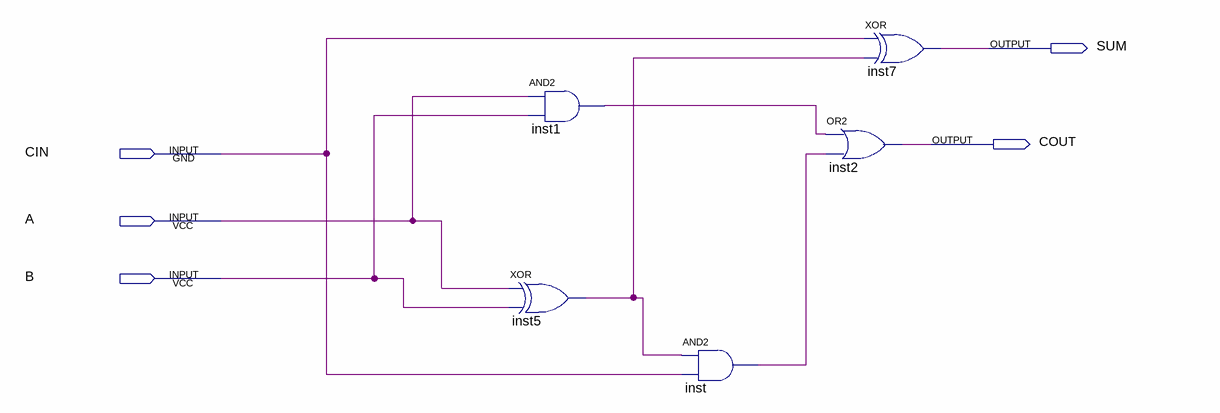
[diagram p0: schematic sheet]
// Quartus schematic full_adder_1bit.bdf as structural Verilog: 5 symbols, 5 pins
module full_adder_1bit (
  input  CIN,
  input  A,
  input  B,
  output SUM,
  output COUT
);

  wire inst1_out, inst5_out, inst_out;

  xor inst5 (inst5_out, A, B);
  and inst1 (inst1_out, A, B);
  and inst (inst_out, inst5_out, CIN);
  or inst2 (COUT, inst1_out, inst_out);
  xor inst7 (SUM, CIN, inst5_out);
endmodule
